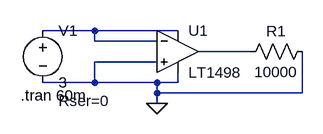
[diagram p0: schematic Draft1.asc]
Draft1.asc, the LTspice schematic file:
Version 4
SHEET 1 880 680
WIRE 32 176 -48 176
WIRE 160 176 32 176
WIRE 32 192 32 176
WIRE 128 192 32 192
WIRE 272 208 192 208
WIRE 128 224 32 224
WIRE 32 256 32 224
WIRE 32 256 -48 256
WIRE 128 256 32 256
WIRE 160 256 160 240
WIRE 160 256 128 256
WIRE 128 272 128 256
WIRE 352 272 352 208
WIRE 352 272 128 272
WIRE 128 288 128 272
FLAG 128 288 0
SYMBOL Opamps\\LT1498 160 144 R0
SYMATTR InstName U1
SYMBOL voltage -48 160 R0
WINDOW 123 0 0 Left 0
WINDOW 39 24 124 Left 2
SYMATTR InstName V1
SYMATTR Value 3
SYMATTR SpiceLine Rser=0
SYMBOL res 256 224 R270
WINDOW 0 32 56 VTop 2
WINDOW 3 0 56 VBottom 2
SYMATTR InstName R1
SYMATTR Value 10000
TEXT -82 276 Left 2 !.tran 60m

The netlist it stands for:
* Draft1.asc
XU1 0 N001 N001 0 N002 LT1498  ; pins In+ In- V+ V- OUT
V1 N001 0 3 Rser=0
R1 N002 0 10000
.tran 60m
.lib LTC.lib
.backanno
.end